# EAGLE design breadboard power supply 2nd (EAGLE 6.1)
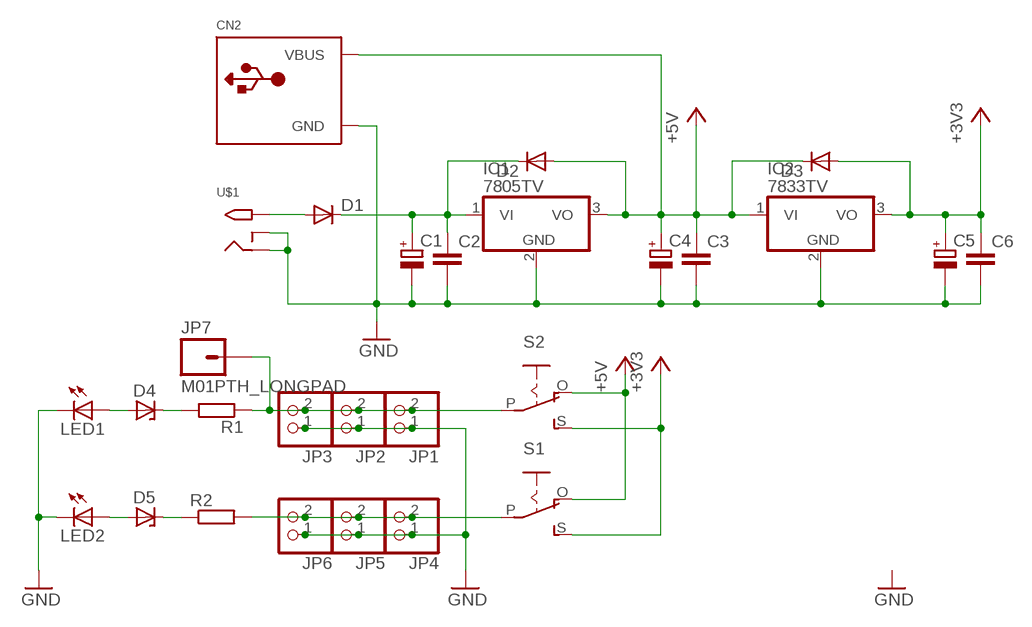
[diagram p0: schematic, sheet 1]

## Parts
C1  CPOL-EUE2.5-6  [E2,5-6]
C2  C-EU025-025X050  [C025-025X050]
C3  C-EU025-025X050  [C025-025X050]
C4  CPOL-EUE2.5-6  [E2,5-6]
C5  CPOL-EUE2.5-6  [E2,5-6]
C6  C-EU025-025X050  [C025-025X050]
CN2  USB  [USB-MINIB-THM]
D1  DIODE-D-5  [D-5]
D2  DIODE-D-5  [D-5]
D3  DIODE-D-5  [D-5]
D4  ZENER-DIODEZD-2.5  [ZDIO-2.5]
D5  ZENER-DIODEZD-2.5  [ZDIO-2.5]
IC1  7805TV  [TO220V]
IC2  7833TV  7805TV  [TO220V]
JP1  PINHD-1X2  [1X02]
JP2  PINHD-1X2  [1X02]
JP3  PINHD-1X2  [1X02]
JP4  PINHD-1X2  [1X02]
JP5  PINHD-1X2  [1X02]
JP6  PINHD-1X2  [1X02]
JP7  M01PTH_LONGPAD  [1X01_LONGPAD]
LED1  LED3MM  [LED3MM]
LED2  LED3MM  [LED3MM]
R1  R-EU_0204/2V  [0204V]
R2  R-EU_0204/2V  [0204V]
S1  EG1218S  [EG1218]
S2  EG1218S  [EG1218]
U$1  2.1MMJACKTHM  [PJ-102A]

## Nets
+3V3: C5.+ C6.1 D3.A IC2.3(VO) S1.S S2.S
+5V: C3.1 C4.+ CN2.VBUS D2.A D3.C IC1.3(VO) IC2.1(VI) S1.O S2.O
GND: C1.- C2.2 C3.2 C4.- C5.- C6.2 CN2.GND IC1.2(GND) IC2.2(GND) JP1.1 JP2.1 JP3.1 JP4.1 JP5.1 JP6.1 LED1.K(C) LED2.K(C) U$1.RING U$1.RING_SW
N$1: D1.A U$1.TIP
N$2: D5.C R2.1
N$3: C1.+ C2.1 D1.C D2.C IC1.1(VI)
N$4: JP1.2 JP2.2 JP3.2 JP7.1 R1.1 S2.P
N$5: D4.C R1.2
N$6: JP4.2 JP5.2 JP6.2 R2.2 S1.P
N$7: D4.A LED1.A
N$8: D5.A LED2.A

## Library data of the parts
C1 C4 C5 = rcl:CPOL-EU: POLARIZED CAPACITOR, European symbol
C2 C3 C6 = rcl:C-EU: CAPACITOR, European symbol
CN2 = _MY_OWN_LIB:USB: USB Connectors USBMINIB - Surface Mount Female Mini-B USB Connector 4UConnector: 06564 By microbuilder.eu Thru-hole RA Female Mini-B USB Connector 4UConnector: 18732 By ladyada.net
D1-D3 = diode:DIODE-: DIODE
D4 D5 = diode:ZENER-DIODE: Z-Diode
IC1 IC2 = linear:78*: Positive VOLTAGE REGULATOR Source: http://cache.national.com/ds/LM/LM78L05.pdf http://www.fairchildsemi.com/ds/LM/LM7805.pdf
JP1-JP6 = pinhead:PINHD-1X2: PIN HEADER
JP7 = _MY_OWN_LIB:M01: Header 1 Standard 1-pin 0.1" header. Use with straight break away headers (SKU : PRT-00116), right angle break away headers (PRT-00553), swiss pins (PRT-00743), machine pins (PRT-00117), and female headers (PRT-00115).
LED1 LED2 = led:LED: LED OSRAM: - CHIPLED LG R971, LG N971, LY N971, LG Q971, LY Q971, LO R971, LY R971 LH N974, LH R974 LS Q976, LO Q976, LY Q976 LO Q996 - Hyper CHIPLED LW Q18S LB Q993, LB Q99A, LB R99A - SideLED LS A670, LO A670, LY A670, LG A670, LP A670 LB A673, LV A673, LT A673, LW A673 LH A674 LY A675 LS A676, LA A676, LO A676, LY A676, LW A676 LS A679, LY A679, LG A679 - Hyper Micro SIDELED® LS Y876, LA Y876, LO Y876, LY Y876 LT Y87S - SmartLED LW L88C, LW L88S LB L89C, LB L89S, LG L890 LS L89K, LO L89K, LY L89K LS L896, LA L896, LO L896, LY L896 - TOPLED LS T670, LO T670, LY T670, LG T670, LP T670 LSG T670, LSP T670, LSY T670, LOP T670, LYG T670 LG T671, LOG T671, LSG T671 LB T673, LV T673, LT T673, LW T673 LH T674 LS T676, LA T676, LO T676, LY T676, LB T676, LH T676, LSB T676, LW T676 LB T67C, LV T67C, LT T67C, LS T67K, LO T67K, LY T67K, LW E67C LS E67B, LA E67B, LO E67B, LY E67B, LB E67C, LV E67C, LT E67C LW T67C LS T679, LY T679, LG T679 LS T770, LO T770, LY T770, LG T770, LP T770 LB T773, LV T773, LT T773, LW T773 LH T774 LS E675, LA E675, LY E675, LS T675 LS T776, LA T776, LO T776, LY T776, LB T776 LHGB T686 LT T68C, LB T68C - Hyper Mini TOPLED® LB M676 - Mini TOPLED Santana® LG M470 LS M47K, LO M47K, LY M47K Source: http://www.osram.convergy.de LUXEON: - LUMILED® LXK2-PW12-R00, LXK2-PW12-S00, LXK2-PW14-U00, LXK2-PW14-V00 LXK2-PM12-R00, LXK2-PM12-S00, LXK2-PM14-U00 LXK2-PE12-Q00, LXK2-PE12-R00, LXK2-PE12-S00, LXK2-PE14-T00, LXK2-PE14-U00 LXK2-PB12-K00, LXK2-PB12-L00, LXK2-PB12-M00, LXK2-PB14-N00, LXK2-PB14-P00, LXK2-PB14-Q00 LXK2-PR12-L00, LXK2-PR12-M00, LXK2-PR14-Q00, LXK2-PR14-R00 LXK2-PD12-Q00, LXK2-PD12-R00, LXK2-PD12-S00 LXK2-PH12-R00, LXK2-PH12-S00 LXK2-PL12-P00, LXK2-PL12-Q00, LXK2-PL12-R00 Source: www.luxeon.com KINGBRIGHT: KA-3528ASYC Source: www.kingbright.com
R1 R2 = rcl:R-EU_: RESISTOR, European symbol
S1 S2 = _MY_OWN_LIB:EG1218: SLIDING SWITCH 0.1" spacing through hole, vertical SPDT slide switch http://www.ladyada.net/library/pcb/eaglelibrary.html
U$1 = adafruit:2.1MMJACK: 2.1mm x 5.5mm THM DC jack with internal switch. Digikey part #PJ-102A, 4UCON part #05537 2.1mm x 5.5mm SMT DC jack with internal switch. Digikey part #PJ-002A-SMT, 4UCON part #03267 By microbuilder.eu & adafruit.com

## Board
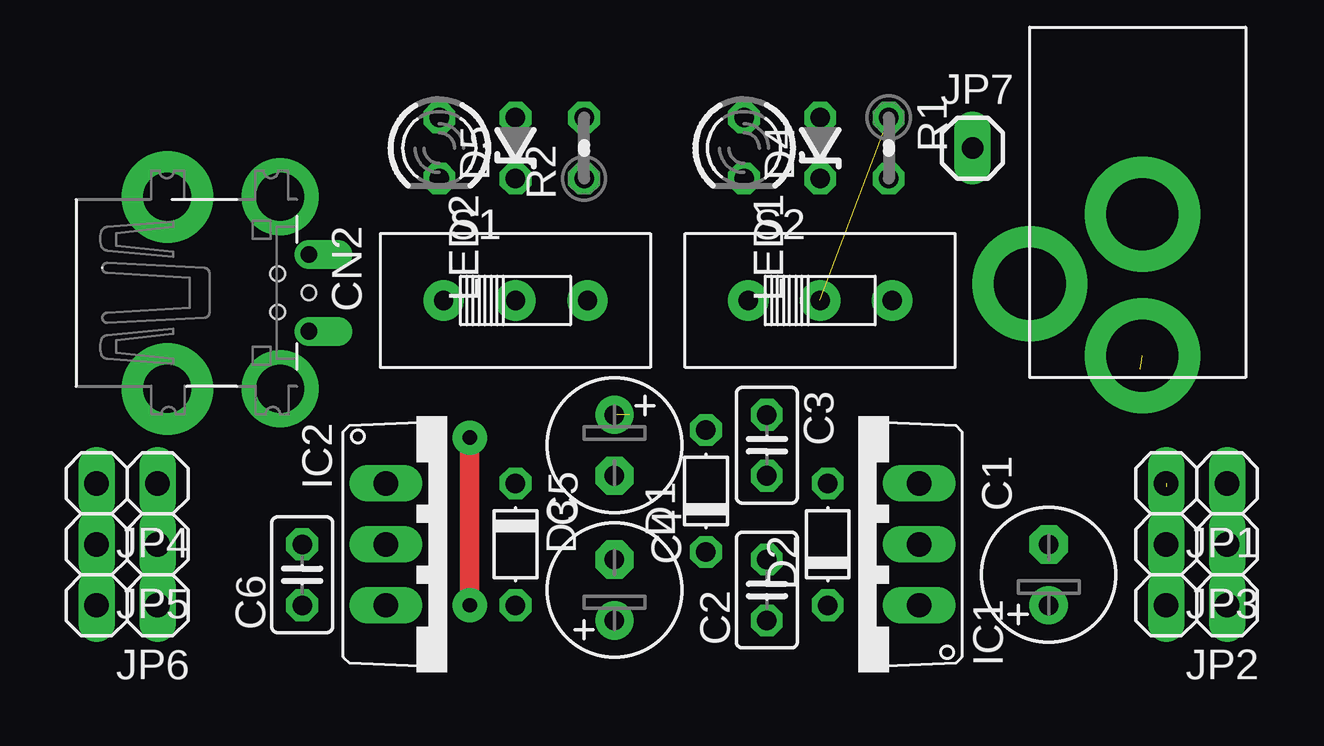
[diagram p1: board, top side]
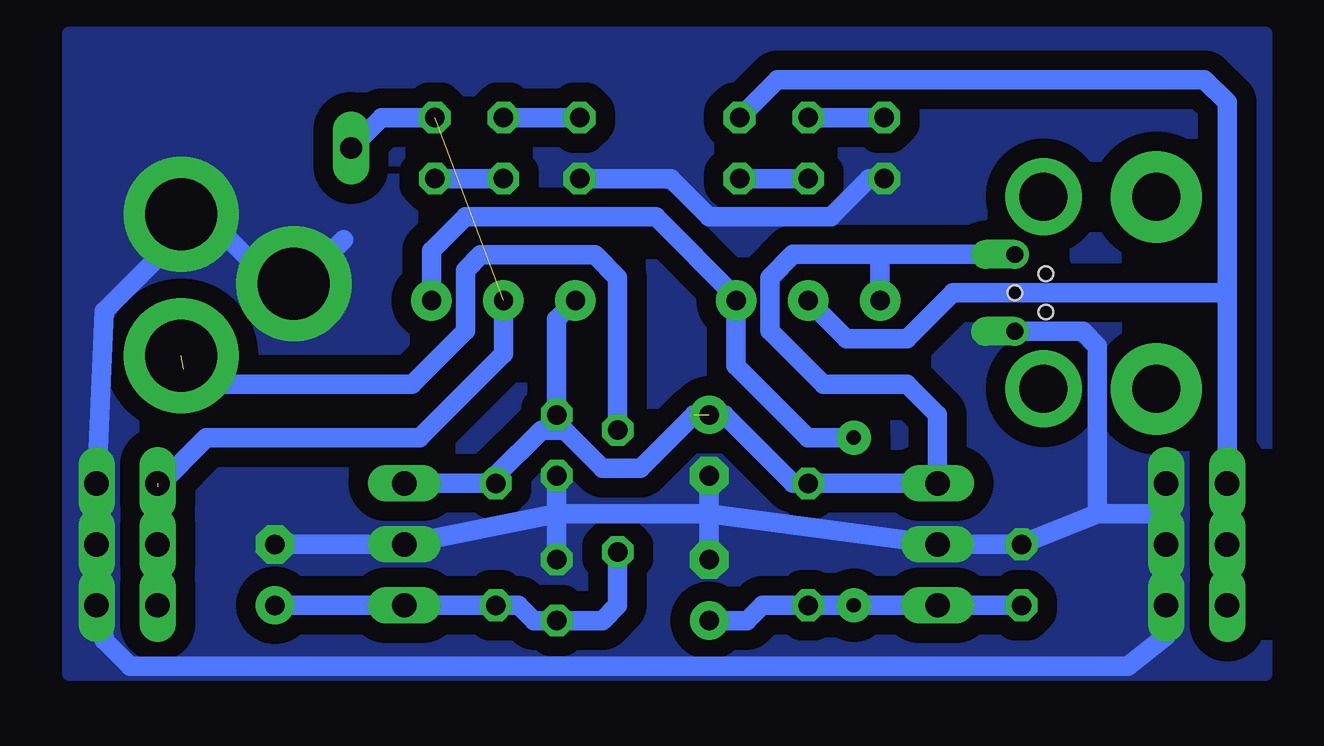
[diagram p2: board, bottom side, seen from below]

No outline drawn. Coordinates in mm, seen from the top.
Copper layers (1*16): Top 0.035mm / dielectric 1.5mm / Bottom 0.035mm
Design rules: minimum track width 10mil, minimum drill 24mil, track to track 12mil, track to pad 12mil, pad to pad 12mil, via to via 12mil, smd to smd 10mil, copper to edge 12mil, drill to drill 12mil, minimum pad ring 10mil, minimum via ring 10mil, stop-mask expansion 4mil, vias tented up to drill 0mil, thermal gap 12mil

### Footprints (pad centres in the part's own frame; a part is rotated, then mirrored left to right if it is on the bottom)
E2,5-6 = drill 0.813 pad 1.6: + -1.27,0 | drill 0.813 pad 1.6 octagon: - 1.27,0
C025-025X050 = drill 0.813 octagon: 1 -1.27,0; 2 1.27,0
USB-MINIB-THM = drill 0.7 offset: GND 1.6,9.8; VBUS -1.6,9.8 | drill 2 pad 3.81: GND1 -4,3.9; GND4 4,3.9 | drill 2 pad 3.2: GND2 -4,8.6; GND3 4,8.6 | hole 0.6: 0,9.8; -0.8,8.5; 0.8,8.5
D-5 = drill 0.813 octagon: A 2.54,0; C -2.54,0
ZDIO-2.5 = drill 0.813 octagon: A 1.27,0; C -1.27,0
TO220V = drill 1.016 long: 1 -2.54,-2.54; 2 0,-2.54; 3 2.54,-2.54
1X02 = drill 1.016 long: 1 -1.27,0; 2 1.27,0
1X01_LONGPAD = drill 0.9 pad 1.524 long: 1 0,0
LED3MM = drill 0.813 octagon: A -1.27,0; K 1.27,0
0204V = drill 0.813 octagon: 1 -1.27,0; 2 1.27,0
EG1218 = drill 0.8 pad 1.676: O -3,0; P 0,0; S 3,0
PJ-102A = drill 3 pad 4.8: RING 0.1,-3.39; RING_SW -4.6,-6.29; TIP 0.1,-9.29

### Placement (x,y rotation side)
C1  41.91,5.08 90 top
C2  30.16,4.45 90 top
C3  30.16,10.48 270 top
C4  23.81,10.48 270 top
C5  23.81,4.45 90 top
C6  10.79,5.08 90 top
CN2  1.27,16.83 270 top
D1  27.62,8.57 90 top
D2  32.7,6.35 90 top
D3  19.68,6.35 270 top
D4  32.38,22.86 90 top
D5  19.68,22.86 90 top
IC1  33.97,6.35 90 top
IC2  16.83,6.35 270 top
JP1  48.08,8.89 180 top
JP2  48.08,3.81 180 top
JP3  48.08,6.35 180 top
JP4  3.49,8.89 180 top
JP5  3.49,6.35 180 top
JP6  3.49,3.81 180 top
JP7  38.73,22.86 0 top
LED1  29.21,22.86 270 top
LED2  16.51,22.86 270 top
R1  35.24,22.86 270 top
R2  22.54,22.86 90 top
S1  19.68,16.51 0 top
S2  32.38,16.51 0 top
U$1  45.72,23.5 0 top

### Tracks (layer width: path | path; a pad name or v marks a point on that pad's centre or on a via)
+3V3  (via drill 0.6 pad 1.42)
  Top 0.813: v17.78,3.81 v17.78,10.79
  Bottom 0.813: C6.1 IC2.3 v17.78,3.81 D3.A 21.59,3.81 22.23,3.17 C5.+ | v17.78,10.79 19.68,10.79 22.68,13.79 S1.S 22.68,16.65 26.04,20 33.97,20 35.38,18.59 S2.S
+5V  (1 unrouted)
  Bottom 0.813: IC1.3 D2.A 32.7,9.21 30.8,11.11 30.16,11.11 | CN2.VBUS 16.51,18.43 | 16.51,18.43 20.31,18.43 21.27,17.46 21.27,15.24 19.05,13.02 15.56,13.02 14.29,11.75 IC2.1 D3.C 20.32,8.89 23.18,11.75 24.45,11.75 26.67,9.53 28.26,9.53 29.84,11.11 30.16,11.11 | S1.O 16.68,18.25 16.51,18.43 | 30.16,11.11 C3.1 30.16,15.73 S2.O
GND
  Bottom 0.813: 23.81,7.62 IC2.2 C6.2 7.62,7.62 | 23.81,7.62 30.16,7.62 | 30.16,7.62 IC1.2 C1.- | C4.- 23.81,7.62 | 23.81,7.62 C5.- | C3.2 30.16,7.62 | 30.16,7.62 C2.2 | JP1.1 JP3.1 JP2.1 | JP4.1 4.76,7.62 | 4.76,7.62 JP5.1 JP6.1 4.76,2.54 6.35,1.27 47.94,1.27 49.03,2.35 JP1.1 | 7.62,7.62 4.76,7.62 | JP1.1 49.03,16.06 45.72,19.37 44.13,19.37 41.27,16.51 | CN2.GND 8.24,15.23 7.62,14.61 7.62,7.62 | 39.05,19.05 40.96,17.14 | LED2.K 17.14,21.59 18.73,20 23.81,20 25.4,21.59 LED1.K
  pour Bottom (isolate 0.813, no thermals): 0.64,0.95 50.48,0.95 50.48,27.62 0.64,27.62
N$1  (1 unrouted)
  Bottom 0.813: D1.A 27.62,17.46 28.57,18.41 33.34,18.41 33.97,17.78 33.97,15.24 36.2,13.02 45.09,13.02 45.72,13.65
N$2
  Bottom 0.813: D5.C R2.1
N$3
  Bottom 0.813: C1.+ IC1.1 D2.C 31.75,3.81 31.11,3.17 C2.1 28.26,3.17 27.62,3.81 D1.C
N$4  (2 unrouted)
  Bottom 0.813: S2.P 32.38,14.29 35.88,10.79 44.77,10.79 46.8,8.76 JP3.2 JP2.2 | R1.1 37.47,24.13 JP7.1
N$5
  Bottom 0.813: D4.C R1.2
N$6
  Bottom 0.813: JP6.2 JP5.2 JP4.2 2.22,16.83 | S1.P 18.1,14.92 15.56,14.92 13.65,16.83 2.22,16.83 | R2.2 20.95,25.72 3.17,25.72 2.22,24.77 2.22,16.83
N$7
  Bottom 0.813: LED1.A D4.A
N$8
  Bottom 0.813: LED2.A D5.A